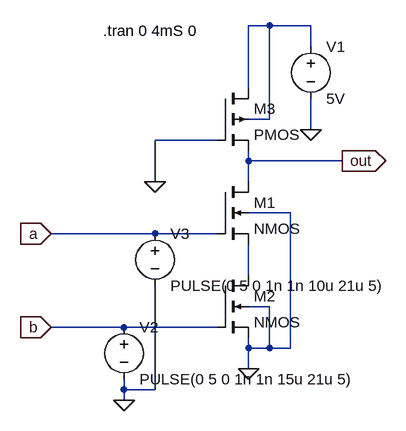
[diagram p0: schematic pseudo_nmos_NAND.asc]
pseudo_nmos_NAND.asc, the LTspice schematic file:
Version 4
SHEET 1 880 680
WIRE 336 -176 304 -176
WIRE 400 -176 336 -176
WIRE 400 -144 400 -176
WIRE 304 -80 304 -176
WIRE 336 -32 336 -176
WIRE 336 -32 304 -32
WIRE 400 -16 400 -64
WIRE 256 0 160 0
WIRE 304 32 304 16
WIRE 448 32 304 32
WIRE 160 64 160 0
WIRE 304 64 304 32
WIRE 368 112 304 112
WIRE 160 144 0 144
WIRE 256 144 160 144
WIRE 304 208 304 160
WIRE 336 256 304 256
WIRE 112 288 0 288
WIRE 256 288 112 288
WIRE 304 320 304 304
WIRE 336 320 336 256
WIRE 336 320 304 320
WIRE 368 320 368 112
WIRE 368 320 336 320
WIRE 304 352 304 320
WIRE 112 384 112 368
WIRE 160 384 160 224
WIRE 160 384 112 384
WIRE 112 400 112 384
FLAG 304 352 0
FLAG 400 -16 0
FLAG 448 32 out
IOPIN 448 32 Out
FLAG 112 400 0
FLAG 160 64 0
FLAG 0 144 a
IOPIN 0 144 In
FLAG 0 288 b
IOPIN 0 288 In
SYMBOL nmos4 256 64 R0
SYMATTR InstName M1
SYMBOL nmos4 256 208 R0
SYMATTR InstName M2
SYMBOL pmos4 256 -80 R0
SYMATTR InstName M3
SYMBOL voltage 400 -160 R0
WINDOW 123 0 0 Left 0
WINDOW 39 0 0 Left 0
SYMATTR InstName V1
SYMATTR Value 5V
SYMBOL voltage 112 272 R0
WINDOW 123 0 0 Left 0
WINDOW 39 0 0 Left 0
SYMATTR InstName V2
SYMATTR Value PULSE(0 5 0 1n 1n 15u 21u 5)
SYMBOL voltage 160 128 R0
WINDOW 123 0 0 Left 0
WINDOW 39 0 0 Left 0
SYMATTR InstName V3
SYMATTR Value PULSE(0 5 0 1n 1n 10u 21u 5)
TEXT 80 -168 Left 2 !.tran 0 4mS 0

The netlist it stands for:
* pseudo_nmos_NAND.asc
M1 out a N002 0 NMOS
M2 N002 b 0 0 NMOS
M3 N001 0 out N001 PMOS
V1 N001 0 5V
V2 b 0 PULSE(0 5 0 1n 1n 15u 21u 5)
V3 a 0 PULSE(0 5 0 1n 1n 10u 21u 5)
.model NMOS NMOS
.model PMOS PMOS
.lib standard.mos
.tran 0 4mS 0
.backanno
.end